# Altium project P1_Final.PrjPcb
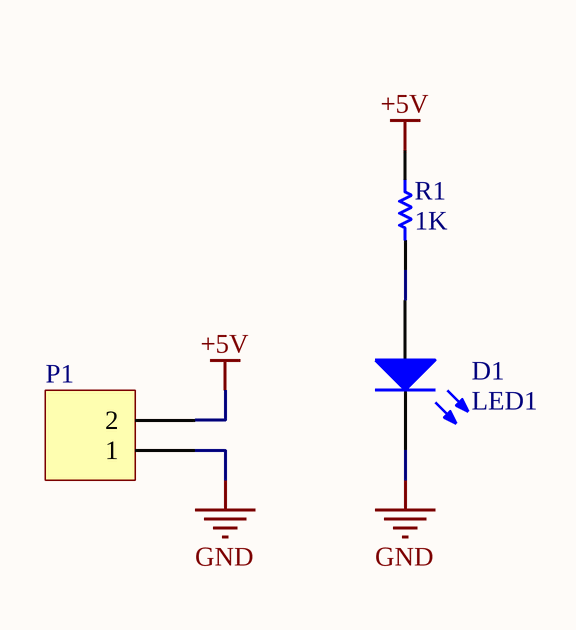
[diagram p0: P1_Final.SchDoc]
1 sheet, 3 parts. Net scope: global (net labels, ports and power ports of the same name join across sheets).
Board file: P1_Final.PcbDoc

## Sheet P1_Final.SchDoc
size A4; SheetNumber: 1; SheetTotal: 1

### Parts
D1  LED1  [LED-1]
P1  Header 2  [HDR1X2]  (value not drawn)
R1  value 1K  [AXIAL-0.3]  (hidden comment: Res1)

### Nets
+5V: P1.2 R1.1
GND: D1.2(K) P1.1
NetD1_1: D1.1(A) R1.2

### Library data of the parts
D1 = LED1: Typical RED GaAs LED; Published: 8-Jun-2000; LatestRevisionDate: 08-Jul-2005; LatestRevisionNote: Mech Layer 1 removed.; PackageReference: LED-1; Publisher: Altium Limited; PackageDescription: LED; 2 Leads
P1 = Header 2: Header, 2-Pin; LatestRevisionDate: 17-Jul-2002; LatestRevisionNote: Re-released for DXP Platform.; Publisher: Altium Limited
R1 = Res1: Resistor; Published: 8-Jun-2000; LatestRevisionDate: 17-Jul-2002; LatestRevisionNote: Re-released for DXP Platform.; PackageReference: AXIAL-0.3; Publisher: Altium Limited; PackageDescription: Axial Device, Thru-Hole; 2 Leads; 0.3 in Pin Spacing